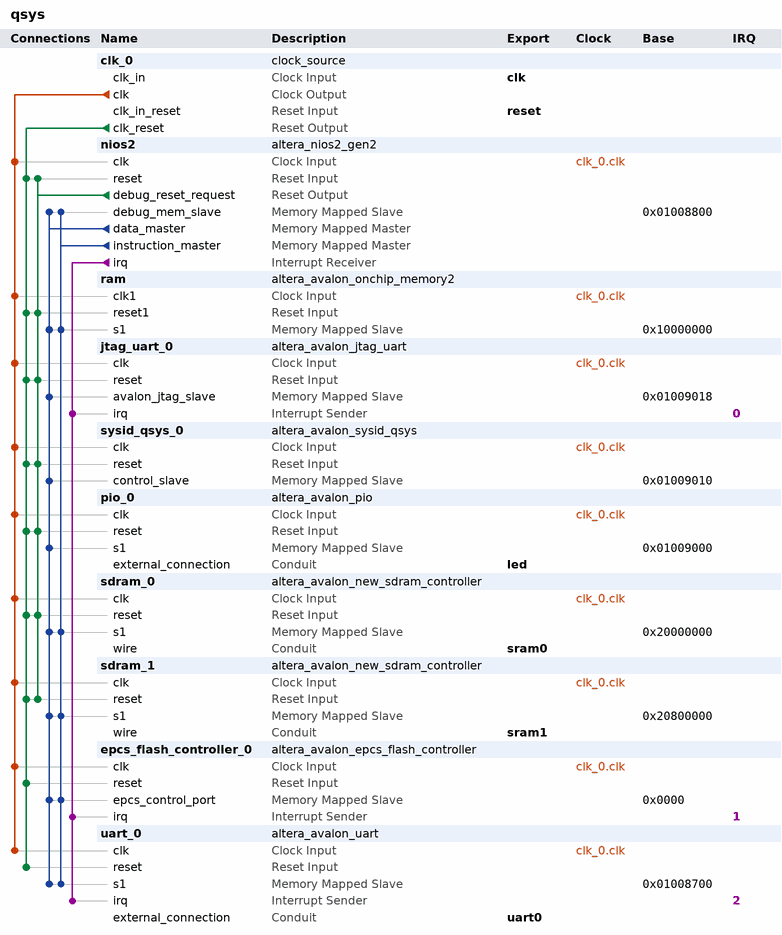
[diagram p0: system contents]
# Platform Designer (Qsys) system qsys, Cyclone IV E EP4CE15F23C8
# Parameters at their usual value, and those the tool derives, are not listed.
package require -exact qsys 18.1
create_system qsys
set_project_property DEVICE_FAMILY {Cyclone IV E}
set_project_property DEVICE EP4CE15F23C8

add_instance clk_0 clock_source 18.1
set_instance_parameter_value clk_0 clockFrequency 150000000

add_instance nios2 altera_nios2_gen2 18.1
set_instance_parameter_value nios2 dcache_size 2048
set_instance_parameter_value nios2 dividerType srt2
set_instance_parameter_value nios2 exceptionSlave ram.s1
set_instance_parameter_value nios2 icache_size 4096
set_instance_parameter_value nios2 impl Fast
set_instance_parameter_value nios2 mul_32_impl 3
set_instance_parameter_value nios2 mul_64_impl 1
set_instance_parameter_value nios2 mul_shift_choice 1
set_instance_parameter_value nios2 resetSlave ram.s1

add_instance ram altera_avalon_onchip_memory2 18.1
set_instance_parameter_value ram dataWidth 32
set_instance_parameter_value ram dualPort false
set_instance_parameter_value ram initMemContent true
set_instance_parameter_value ram initializationFileName onchip_mem.hex
set_instance_parameter_value ram memorySize 20480

add_instance jtag_uart_0 altera_avalon_jtag_uart 18.1
set_instance_parameter_value jtag_uart_0 simInteractiveOptions NO_INTERACTIVE_WINDOWS

add_instance sysid_qsys_0 altera_avalon_sysid_qsys 18.1
set_instance_parameter_value sysid_qsys_0 id 0

add_instance pio_0 altera_avalon_pio 18.1
set_instance_parameter_value pio_0 direction Output
set_instance_parameter_value pio_0 width 1

add_instance sdram_0 altera_avalon_new_sdram_controller 18.1
set_instance_parameter_value sdram_0 TAC 5.5
set_instance_parameter_value sdram_0 TRCD 20.0
set_instance_parameter_value sdram_0 TRP 20.0
set_instance_parameter_value sdram_0 casLatency 3
set_instance_parameter_value sdram_0 columnWidth 8
set_instance_parameter_value sdram_0 dataWidth 32
set_instance_parameter_value sdram_0 generateSimulationModel false
set_instance_parameter_value sdram_0 model single_Micron_MT48LC4M32B2_7_chip
set_instance_parameter_value sdram_0 numberOfBanks 4
set_instance_parameter_value sdram_0 numberOfChipSelects 1
set_instance_parameter_value sdram_0 powerUpDelay 100.0
set_instance_parameter_value sdram_0 refreshPeriod 15.625
set_instance_parameter_value sdram_0 rowWidth 11

add_instance sdram_1 altera_avalon_new_sdram_controller 18.1
set_instance_parameter_value sdram_1 TAC 5.5
set_instance_parameter_value sdram_1 TRCD 20.0
set_instance_parameter_value sdram_1 TRP 20.0
set_instance_parameter_value sdram_1 casLatency 3
set_instance_parameter_value sdram_1 columnWidth 8
set_instance_parameter_value sdram_1 dataWidth 32
set_instance_parameter_value sdram_1 generateSimulationModel false
set_instance_parameter_value sdram_1 model single_Micron_MT48LC4M32B2_7_chip
set_instance_parameter_value sdram_1 numberOfBanks 4
set_instance_parameter_value sdram_1 numberOfChipSelects 1
set_instance_parameter_value sdram_1 powerUpDelay 100.0
set_instance_parameter_value sdram_1 refreshPeriod 15.625
set_instance_parameter_value sdram_1 rowWidth 11

add_instance epcs_flash_controller_0 altera_avalon_epcs_flash_controller 18.1
set_instance_parameter_value epcs_flash_controller_0 resetrequest_enabled true

add_instance uart_0 altera_avalon_uart 18.1
set_instance_parameter_value uart_0 baud 115200
set_instance_parameter_value uart_0 dataBits 8
set_instance_parameter_value uart_0 fixedBaud true
set_instance_parameter_value uart_0 parity NONE
set_instance_parameter_value uart_0 stopBits 1

# connections
add_connection clk_0.clk epcs_flash_controller_0.clk clock
add_connection clk_0.clk jtag_uart_0.clk clock
add_connection clk_0.clk nios2.clk clock
add_connection clk_0.clk pio_0.clk clock
add_connection clk_0.clk ram.clk1 clock
add_connection clk_0.clk sdram_0.clk clock
add_connection clk_0.clk sdram_1.clk clock
add_connection clk_0.clk sysid_qsys_0.clk clock
add_connection clk_0.clk uart_0.clk clock
add_connection clk_0.clk_reset epcs_flash_controller_0.reset reset
add_connection clk_0.clk_reset jtag_uart_0.reset reset
add_connection clk_0.clk_reset nios2.reset reset
add_connection clk_0.clk_reset pio_0.reset reset
add_connection clk_0.clk_reset ram.reset1 reset
add_connection clk_0.clk_reset sdram_0.reset reset
add_connection clk_0.clk_reset sdram_1.reset reset
add_connection clk_0.clk_reset sysid_qsys_0.reset reset
add_connection clk_0.clk_reset uart_0.reset reset
add_connection nios2.debug_reset_request jtag_uart_0.reset reset
add_connection nios2.debug_reset_request nios2.reset reset
add_connection nios2.debug_reset_request pio_0.reset reset
add_connection nios2.debug_reset_request ram.reset1 reset
add_connection nios2.debug_reset_request sdram_0.reset reset
add_connection nios2.debug_reset_request sdram_1.reset reset
add_connection nios2.debug_reset_request sysid_qsys_0.reset reset
add_connection nios2.data_master epcs_flash_controller_0.epcs_control_port avalon
set_connection_parameter_value nios2.data_master/epcs_flash_controller_0.epcs_control_port baseAddress 0x0000
add_connection nios2.data_master jtag_uart_0.avalon_jtag_slave avalon
set_connection_parameter_value nios2.data_master/jtag_uart_0.avalon_jtag_slave baseAddress 0x01009018
add_connection nios2.data_master nios2.debug_mem_slave avalon
set_connection_parameter_value nios2.data_master/nios2.debug_mem_slave baseAddress 0x01008800
add_connection nios2.data_master pio_0.s1 avalon
set_connection_parameter_value nios2.data_master/pio_0.s1 baseAddress 0x01009000
add_connection nios2.data_master ram.s1 avalon
set_connection_parameter_value nios2.data_master/ram.s1 baseAddress 0x10000000
add_connection nios2.data_master sdram_0.s1 avalon
set_connection_parameter_value nios2.data_master/sdram_0.s1 baseAddress 0x20000000
add_connection nios2.data_master sdram_1.s1 avalon
set_connection_parameter_value nios2.data_master/sdram_1.s1 baseAddress 0x20800000
add_connection nios2.data_master sysid_qsys_0.control_slave avalon
set_connection_parameter_value nios2.data_master/sysid_qsys_0.control_slave baseAddress 0x01009010
add_connection nios2.data_master uart_0.s1 avalon
set_connection_parameter_value nios2.data_master/uart_0.s1 baseAddress 0x01008700
add_connection nios2.instruction_master epcs_flash_controller_0.epcs_control_port avalon
set_connection_parameter_value nios2.instruction_master/epcs_flash_controller_0.epcs_control_port baseAddress 0x0000
add_connection nios2.instruction_master nios2.debug_mem_slave avalon
set_connection_parameter_value nios2.instruction_master/nios2.debug_mem_slave baseAddress 0x01008800
add_connection nios2.instruction_master ram.s1 avalon
set_connection_parameter_value nios2.instruction_master/ram.s1 baseAddress 0x10000000
add_connection nios2.instruction_master sdram_0.s1 avalon
set_connection_parameter_value nios2.instruction_master/sdram_0.s1 baseAddress 0x20000000
add_connection nios2.instruction_master sdram_1.s1 avalon
set_connection_parameter_value nios2.instruction_master/sdram_1.s1 baseAddress 0x20800000
add_connection nios2.instruction_master uart_0.s1 avalon
set_connection_parameter_value nios2.instruction_master/uart_0.s1 baseAddress 0x01008700
add_connection nios2.irq epcs_flash_controller_0.irq interrupt
set_connection_parameter_value nios2.irq/epcs_flash_controller_0.irq irqNumber 1
add_connection nios2.irq jtag_uart_0.irq interrupt
set_connection_parameter_value nios2.irq/jtag_uart_0.irq irqNumber 0
add_connection nios2.irq uart_0.irq interrupt
set_connection_parameter_value nios2.irq/uart_0.irq irqNumber 2

# exported interfaces
add_interface clk clock sink
set_interface_property clk EXPORT_OF clk_0.clk_in
add_interface led conduit end
set_interface_property led EXPORT_OF pio_0.external_connection
add_interface reset reset sink
set_interface_property reset EXPORT_OF clk_0.clk_in_reset
add_interface sram0 conduit end
set_interface_property sram0 EXPORT_OF sdram_0.wire
add_interface sram1 conduit end
set_interface_property sram1 EXPORT_OF sdram_1.wire
add_interface uart0 conduit end
set_interface_property uart0 EXPORT_OF uart_0.external_connection

set_interconnect_requirement {$system} qsys_mm.clockCrossingAdapter HANDSHAKE
set_interconnect_requirement {$system} qsys_mm.enableEccProtection FALSE
set_interconnect_requirement {$system} qsys_mm.insertDefaultSlave FALSE
set_interconnect_requirement {$system} qsys_mm.maxAdditionalLatency 1

save_system qsys.qsys
